# EAGLE design rpi_industrial_hat (EAGLE 9.6.2)
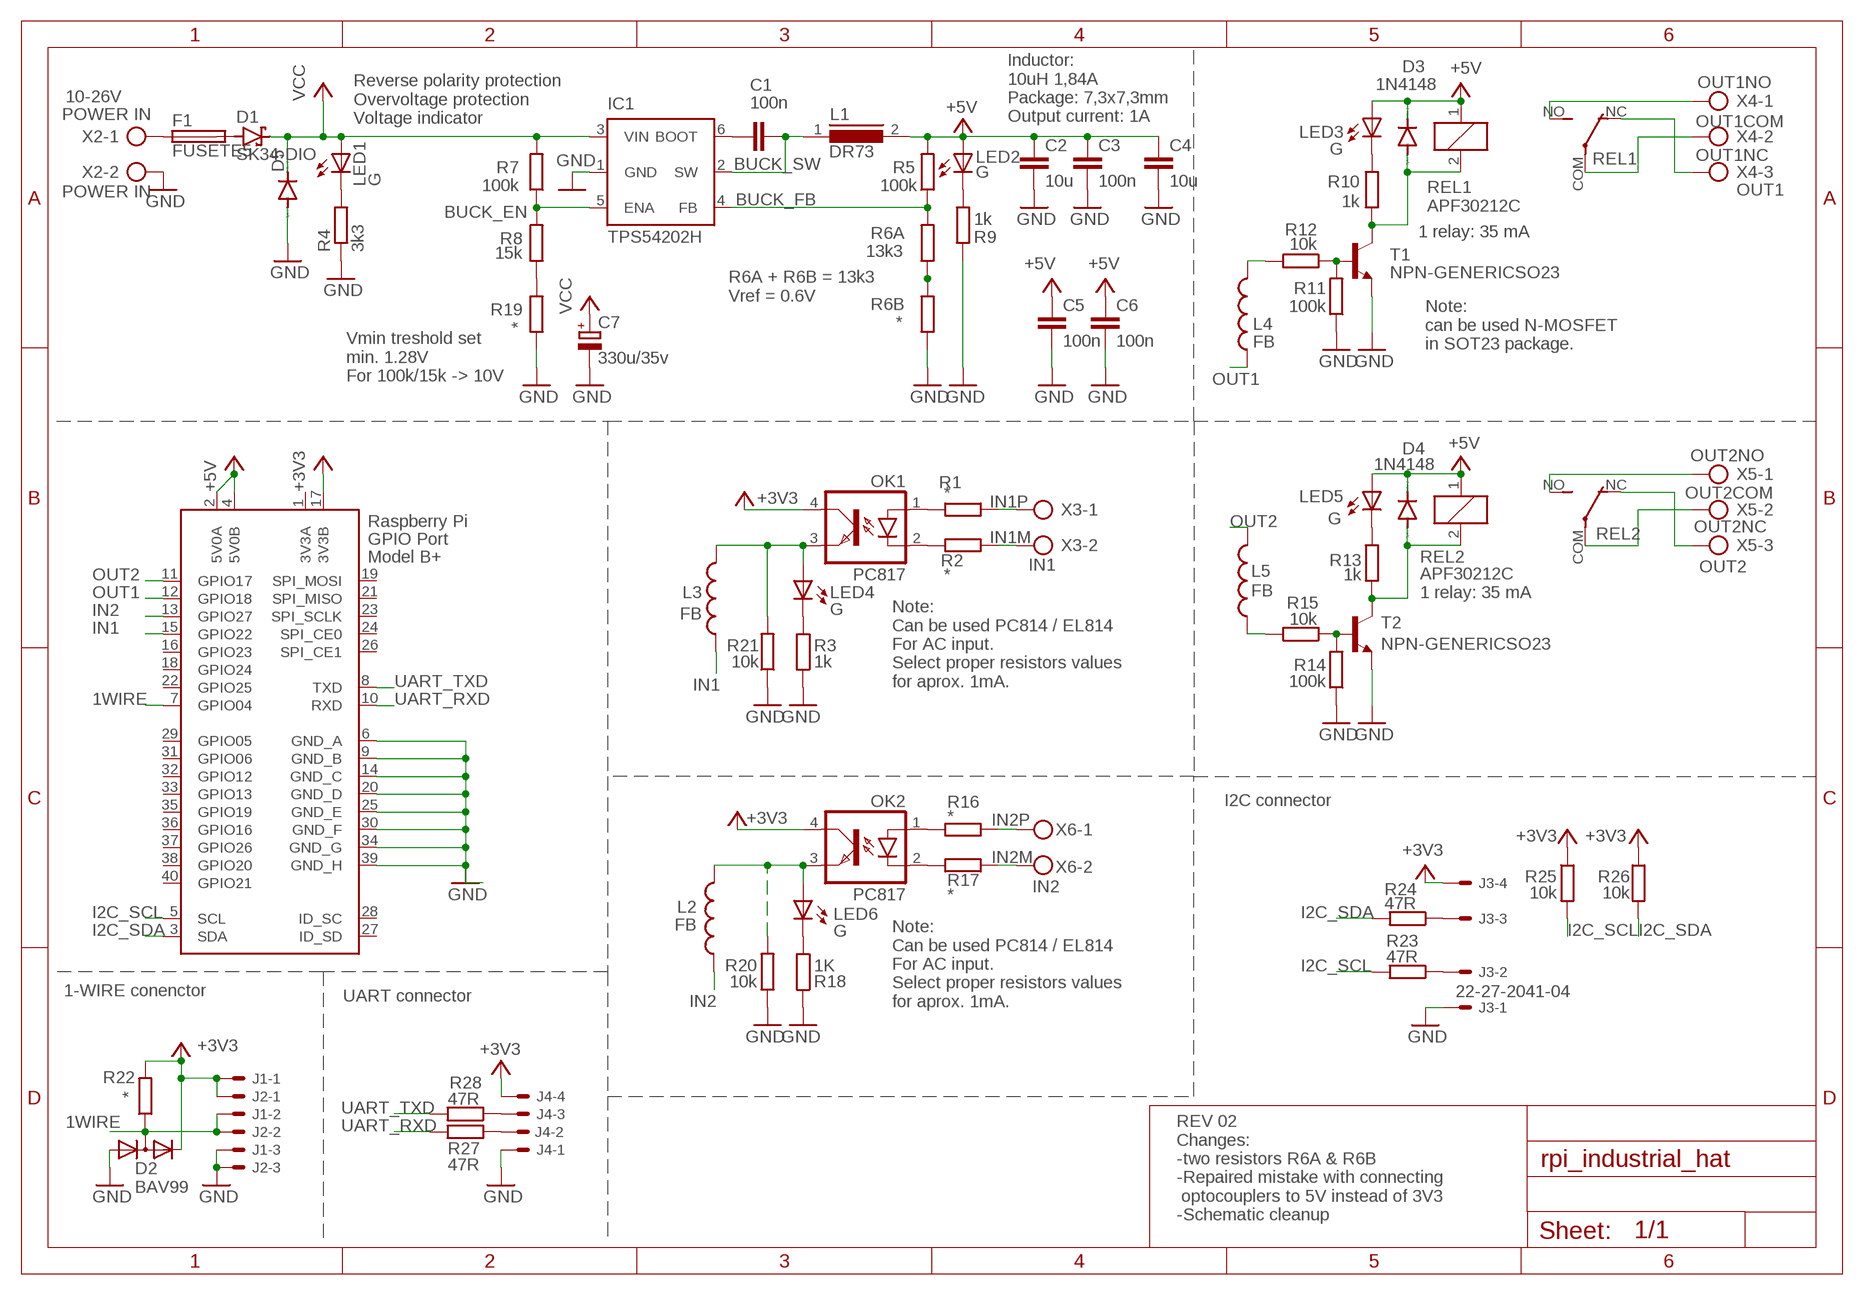
[diagram p0: schematic, sheet 1]

## Parts
C1  100n  C-EUC0603  [C0603]
C2  10u  C-EUC0805  [C0805]
C3  100n  C-EUC0603  [C0603]
C4  10u  C-EUC0805  [C0805]
C5  100n  C-EUC0603  [C0603]
C6  100n  C-EUC0603  [C0603]
C7  330u/35v  CPOL-EUE5-10.5  [E5-10,5]
D1  SK34-DIO  SCHOTTKY-DIODESMC  [SMC]
D2  BAV99  [SOT23]
D3  1N4148  DIODE-MINIMELF  [MINIMELF]
D4  1N4148  DIODE-MINIMELF  [MINIMELF]
D5  DIODE-DO214AA  [DO214AA]
F1  FUSETE5  [TE5]
IC1  TPS54202H  [SOT23-6]
J1  22-27-2031-03  [6410-03]
J2  22-27-2031-03  [6410-03]
J3  22-27-2041-04  [6410-04]
J4  22-27-2041-04  [6410-04]
L1  DR73  [DR73]
L2  FB  INDUCTOR0603  [0603]
L3  FB  INDUCTOR0603  [0603]
L4  FB  INDUCTOR0603  [0603]
L5  FB  INDUCTOR0603  [0603]
LED1  G  LEDCHIP-LED0603  [CHIP-LED0603]
LED2  G  LEDCHIP-LED0603  [CHIP-LED0603]
LED3  G  LEDCHIP-LED0603  [CHIP-LED0603]
LED4  G  LEDCHIP-LED0603  [CHIP-LED0603]
LED5  G  LEDCHIP-LED0603  [CHIP-LED0603]
LED6  G  LEDCHIP-LED0603  [CHIP-LED0603]
OK1  PC817  [DIL04]
OK2  PC817  [DIL04]
R1  *  R_PROTO_0204/7_0805  [0204/7/SMD]
R2  *  R_PROTO_0204/7_0805  [0204/7/SMD]
R3  1k  R-EU_R0603  [R0603]
R4  3k3  R-EU_R0603  [R0603]
R5  100k  R-EU_R0603  [R0603]
R6A  13k3  R-EU_R0603  [R0603]
R6B  *  R-EU_R0603  [R0603]
R7  100k  R-EU_R0603  [R0603]
R8  15k  R-EU_R0603  [R0603]
R9  1k  R-EU_R0603  [R0603]
R10  1k  R-EU_R0603  [R0603]
R11  100k  R-EU_R0603  [R0603]
R12  10k  R-EU_R0603  [R0603]
R13  1k  R-EU_R0603  [R0603]
R14  100k  R-EU_R0603  [R0603]
R15  10k  R-EU_R0603  [R0603]
R16  *  R_PROTO_0204/7_0805  [0204/7/SMD]
R17  *  R_PROTO_0204/7_0805  [0204/7/SMD]
R18  1K  R-EU_R0603  [R0603]
R19  *  R-EU_R0603  [R0603]
R20  10k  R-EU_R0603  [R0603]
R21  10k  R-EU_R0603  [R0603]
R22  *  R-EU_R0603  [R0603]
R23  47R  R-EU_R0603  [R0603]
R24  47R  R-EU_R0603  [R0603]
R25  10k  R-EU_R0603  [R0603]
R26  10k  R-EU_R0603  [R0603]
R27  47R  R-EU_R0603  [R0603]
R28  47R  R-EU_R0603  [R0603]
REL1  APF30212C  [APF30212C]
REL2  APF30212C  [APF30212C]
T1  NPN-GENERICSO23  [SOT23]
T2  NPN-GENERICSO23  [SOT23]
X1  RASPI_BOARD_B+#_E4P  [RASPI_BOARD_B+_EDGES_4DRILL_PAD]
X2  POWER IN  AK500/2  [AK500/2]
X3  IN1  AK500/2  [AK500/2]
X4  OUT1  AK500/3  [AK500/3]
X5  OUT2  AK500/3  [AK500/3]
X6  IN2  AK500/2  [AK500/2]

## Nets
1WIRE: D2.3(K1A2) J1.2 J2.2 R22.1 X1.7(GPIO04)
+3V3: D2.2(K2) J1.1 J2.1 J3.4 J4.4 OK1.4(COL) OK2.4(COL) R22.2 R25.1 R26.1 X1.17(3V3B)
+5V: C2.1 C3.1 C4.1 C5.1 C6.1 D3.C D4.C L1.2 LED2.A LED3.A LED5.A R5.2 REL1.1 REL2.1 X1.2(5V0A) X1.4(5V0B)
BUCK_EN: IC1.5(ENA) R7.1 R8.2
BUCK_FB: IC1.4(FB) R5.1 R6A.2
BUCK_SW: C1.2 IC1.2(SW) L1.1
GND: C2.2 C3.2 C4.2 C5.2 C6.2 C7.- D2.1(A1) D5.A IC1.1(GND) J1.3 J2.3 J3.1 J4.1 R3.1 R4.1 R6B.1 R9.1 R11.1 R14.1 R18.1 R19.1 R20.1 R21.1 T1.2(E) T2.2(E) X1.6(GND_A) X1.9(GND_B) X1.14(GND_C) X1.20(GND_D) X1.25(GND_E) X1.30(GND_F) X1.34(GND_G) X1.39(GND_H) X2.2
I2C_SCL: R23.2 R25.2 X1.5(SCL)
I2C_SDA: R24.2 R26.2 X1.3(SDA)
IN1: L3.1 X1.15(GPIO22)
IN1_: L3.2 LED4.A OK1.3(EMIT) R21.2
IN1M: R2.1 X3.2
IN1P: R1.1 X3.1
IN2: L2.1 X1.13(GPIO27)
IN2_: L2.2 LED6.A OK2.3(EMIT) R20.2
IN2M: R17.1 X6.2
IN2P: R16.1 X6.1
N$1: F1.1 X2.1
N$2: D1.A F1.2
N$3: R8.1 R19.2
N$4: J3.2 R23.1
N$5: J3.3 R24.1
N$6: OK1.1(A) R1.2
N$7: OK1.2(C) R2.2
N$8: J4.2 R27.1
N$9: J4.3 R28.1
N$10: LED4.C R3.2
N$11: C1.1 IC1.6(BOOT)
N$12: LED1.C R4.2
N$13: R6A.1 R6B.2
N$15: D3.A R10.1 REL1.2 T1.3(C)
N$18: LED2.C R9.2
N$19: LED3.C R10.2
N$20: R11.2 R12.1 T1.1(B)
N$21: D4.A R13.1 REL2.2 T2.3(C)
N$22: LED5.C R13.2
N$23: R14.2 R15.1 T2.1(B)
N$24: OK2.1(A) R16.2
N$25: OK2.2(C) R17.2
N$28: LED6.C R18.2
OUT1: L4.1 X1.12(GPIO18)
OUT1_: L4.2 R12.2
OUT1COM: REL1.COM(2:P) X4.2
OUT1NC: REL1.NC(2:O) X4.3
OUT1NO: REL1.NO(2:S) X4.1
OUT2: L5.2 X1.11(GPIO17)
OUT2_: L5.1 R15.2
OUT2COM: REL2.COM(2:P) X5.2
OUT2NC: REL2.NC(2:O) X5.3
OUT2NO: REL2.NO(2:S) X5.1
UART_RXD: R27.2 X1.10(RXD)
UART_TXD: R28.2 X1.8(TXD)
VCC: C7.+ D1.C D5.C IC1.3(VIN) LED1.A R7.2
Unconnected: X1.16(GPIO23) X1.18(GPIO24) X1.19(SPI_MOSI) X1.21(SPI_MISO) X1.22(GPIO25) X1.23(SPI_SCLK) X1.24(SPI_CE0) X1.26(SPI_CE1) X1.27(ID_SD) X1.28(ID_SC) X1.29(GPIO05) X1.31(GPIO06) X1.32(GPIO12) X1.33(GPIO13) X1.35(GPIO19) X1.36(GPIO16) X1.37(GPIO26) X1.38(GPIO20) X1.40(GPIO21)

## Notes on the sheet
- 10-26V
- POWER IN
- Inductor:
  10uH 1,84A
  Package: 7,3x7,3mm
  Output current: 1A
- Reverse polarity protection
  Overvoltage protection
  Voltage indicator
- 1 relay: 35 mA
- R6A + R6B = 13k3
  Vref = 0.6V
- Note:
  can be used N-MOSFET
  in SOT23 package.
- Vmin treshold set
  min. 1.28V
  For 100k/15k -> 10V
- 1 relay: 35 mA
- Note:
  Can be used PC814 / EL814
  For AC input.
  Select proper resistors values
  for aprox. 1mA.
- I2C connector
- 1-WIRE conenctor
- UART connector
- Note:
  Can be used PC814 / EL814
  For AC input.
  Select proper resistors values
  for aprox. 1mA.
- REV 02
  Changes:
  -two resistors R6A & R6B
  -Repaired mistake with connecting 
   optocouplers to 5V instead of 3V3
  -Schematic cleanup

## Power pins joined to a net without a drawn wire
3V3A: X1.1(3V3A)

## Library data of the parts
C1-C6 = rcl:C-EU: CAPACITOR, European symbol; SPICEPREFIX: C
C7 = rcl:CPOL-EU: POLARIZED CAPACITOR, European symbol; SPICEPREFIX: C
D1 = diode:SCHOTTKY-DIODE: Schottky Diode
D2 = nxp_60:BAV99: High-speed switching diode High-speed switching diodes, encapsulated in small Surface-Mounted Device (SMD) plastic packages. AAL Eindhoven MK
D3-D5 = diode:DIODE-: DIODE
F1 = fuse:FUSE: Fuse; OC_FARNELL: unknown; OC_NEWARK: unknown
IC1 = virtmedia:TPS54202H: TPS54202H 4.5-V to 28-V Input, 2-A Output, SWIFT™ Synchronous Step Down Voltage Converter Source: http://www.ti.com/lit/ds/symlink/tps54202h.pdf
J1 J2 = con-molex:22-?-03: CONNECTOR wire to board 2.54 mm (.1 inch) pitch header; MF: MOLEX; OC_FARNELL: unknown; OC_NEWARK: unknown
J3 J4 = con-molex:22-?-04: CONNECTOR wire to board 2.54 mm (.1 inch) pitch header; MF: MOLEX; OC_FARNELL: unknown; OC_NEWARK: unknown
L1 = inductors:DR73: High Power Density, High Efficiency, Shielded Inductors Source: coiltronics_dr_series.pdf; SPICEPREFIX: L
L2-L5 = SparkFun:INDUCTOR: Inductors Basic Inductor/Choke - 0603 and 1206. Footprints are not proven and vary greatly between part numbers.
LED1-LED6 = adafruit-3:LED: LED OSRAM: - CHIPLED LG R971, LG N971, LY N971, LG Q971, LY Q971, LO R971, LY R971 LH N974, LH R974 LS Q976, LO Q976, LY Q976 LO Q996 - Hyper CHIPLED LW Q18S LB Q993, LB Q99A, LB R99A - SideLED LS A670, LO A670, LY A670, LG A670, LP A670 LB A673, LV A673, LT A673, LW A673 LH A674 LY A675 LS A676, LA A676, LO A676, LY A676, LW A676 LS A679, LY A679, LG A679 - Hyper Micro SIDELED® LS Y876, LA Y876, LO Y876, LY Y876 LT Y87S - SmartLED LW L88C, LW L88S LB L89C, LB L89S, LG L890 LS L89K, LO L89K, LY L89K LS L896, LA L896, LO L896, LY L896 - TOPLED LS T670, LO T670, LY T670, LG T670, LP T670 LSG T670, LSP T670, LSY T670, LOP T670, LYG T670 LG T671, LOG T671, LSG T671 LB T673, LV T673, LT T673, LW T673 LH T674 LS T676, LA T676, LO T676, LY T676, LB T676, LH T676, LSB T676, LW T676 LB T67C, LV T67C, LT T67C, LS T67K, LO T67K, LY T67K, LW E67C LS E67B, LA E67B, LO E67B, LY E67B, LB E67C, LV E67C, LT E67C LW T67C LS T679, LY T679, LG T679 LS T770, LO T770, LY T770, LG T770, LP T770 LB T773, LV T773, LT T773, LW T773 LH T774 LS E675, LA E675, LY E675, LS T675 LS T776, LA T776, LO T776, LY T776, LB T776 LHGB T686 LT T68C, LB T68C - Hyper Mini TOPLED® LB M676 - Mini TOPLED Santana® LG M470 LS M47K, LO M47K, LY M47K Source: http://www.osram.convergy.de/
OK1 OK2 = optocoupler:PC817: SHARP OPTO COUPLER; MPN: PC817X4J000F; OC_FARNELL: 9707727; OC_NEWARK: 97K7059
R1 R2 R16 R17 = proto_components:R_PROTO_0204/7_0805: Resistor model for proto boards. Allows to mout at the same place THT axial or 0805/1206 SMT package.
R3-R5 R6A R6B R7-R15 R18-R28 = rcl:R-EU_: RESISTOR, European symbol; SPICEPREFIX: R
REL1 REL2 = relay:APF30212C: Compliant with European standards 1a/1c 6A Slim power relays Source: Data sheet <http://pewa.panasonic.com/assets/pcsd/catalog/pf-catalog.pdf>; OC_FARNELL: unknown
T1 T2 = virtmedia:NPN-GENERIC
X1 = Eagle Mixed Library:RASPI_BOARD_B+#: Raspberry Pi GPIO connector with markings for the outer dimensions of the Raspberry Pi board model B+ with different sets of drill holes or mounting pads All pins connected
X2 X3 X6 = con-ptr500:AK500/2: CONNECTOR; OC_FARNELL: unknown; OC_NEWARK: unknown
X4 X5 = con-ptr500:AK500/3: CONNECTOR; OC_FARNELL: unknown; OC_NEWARK: unknown

## Board
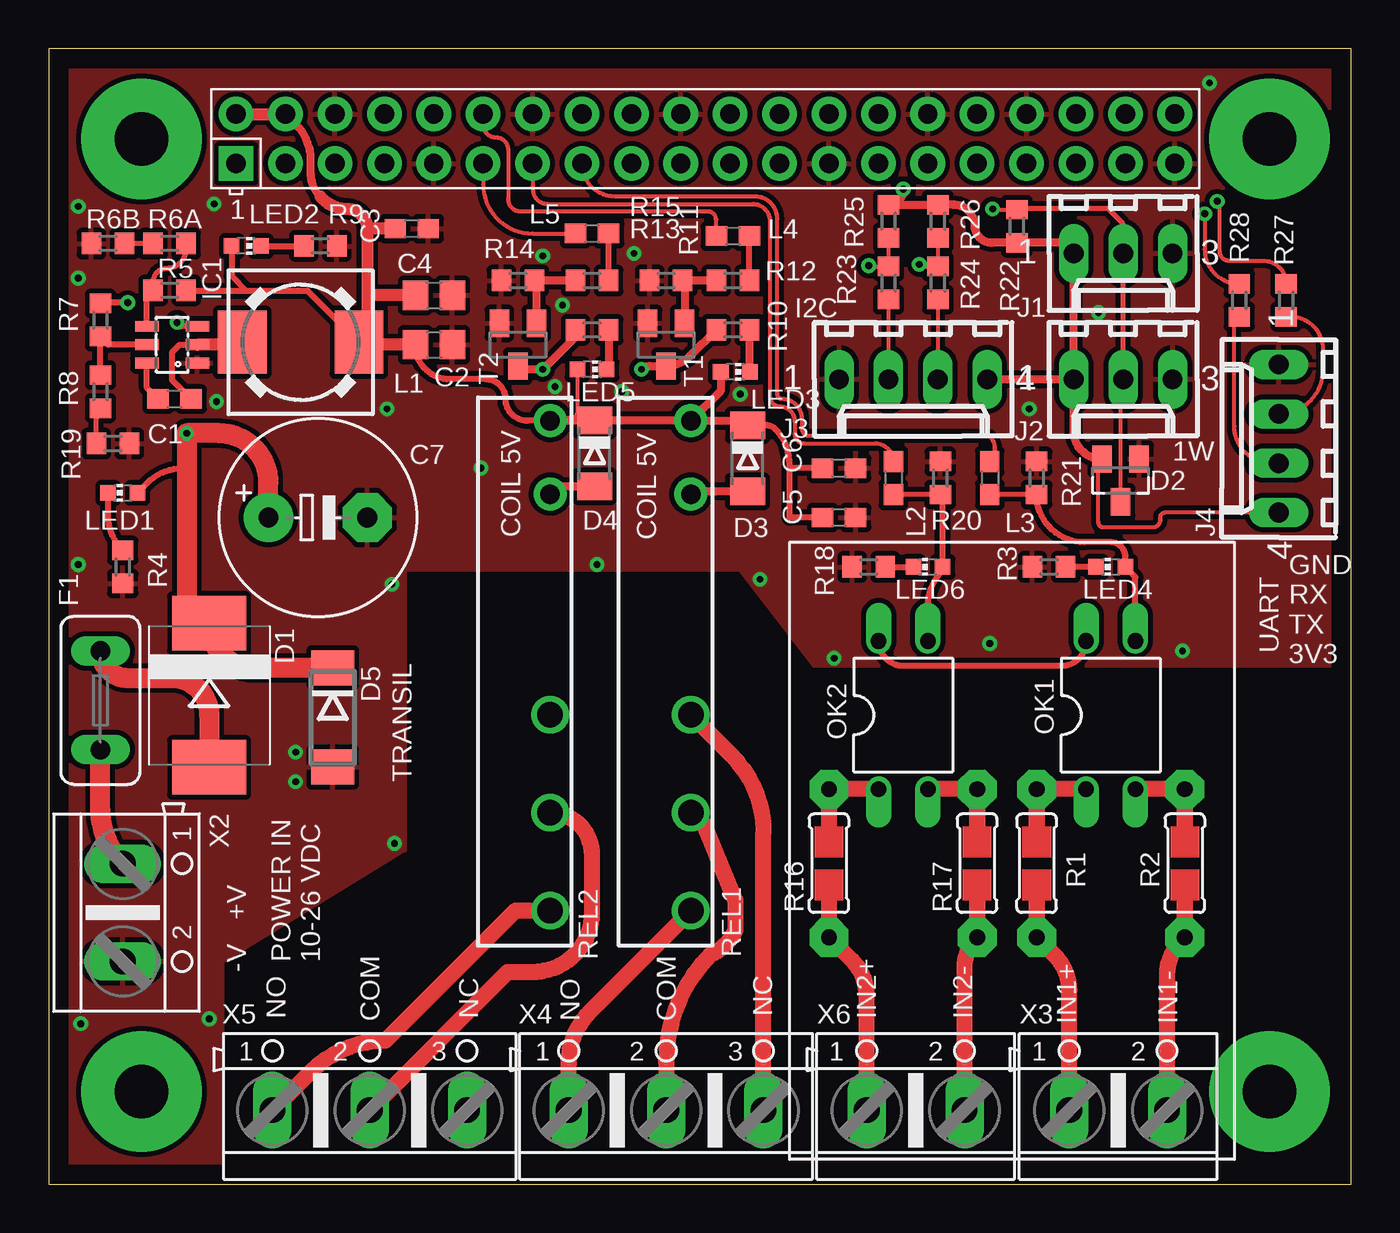
[diagram p1: board, top side]
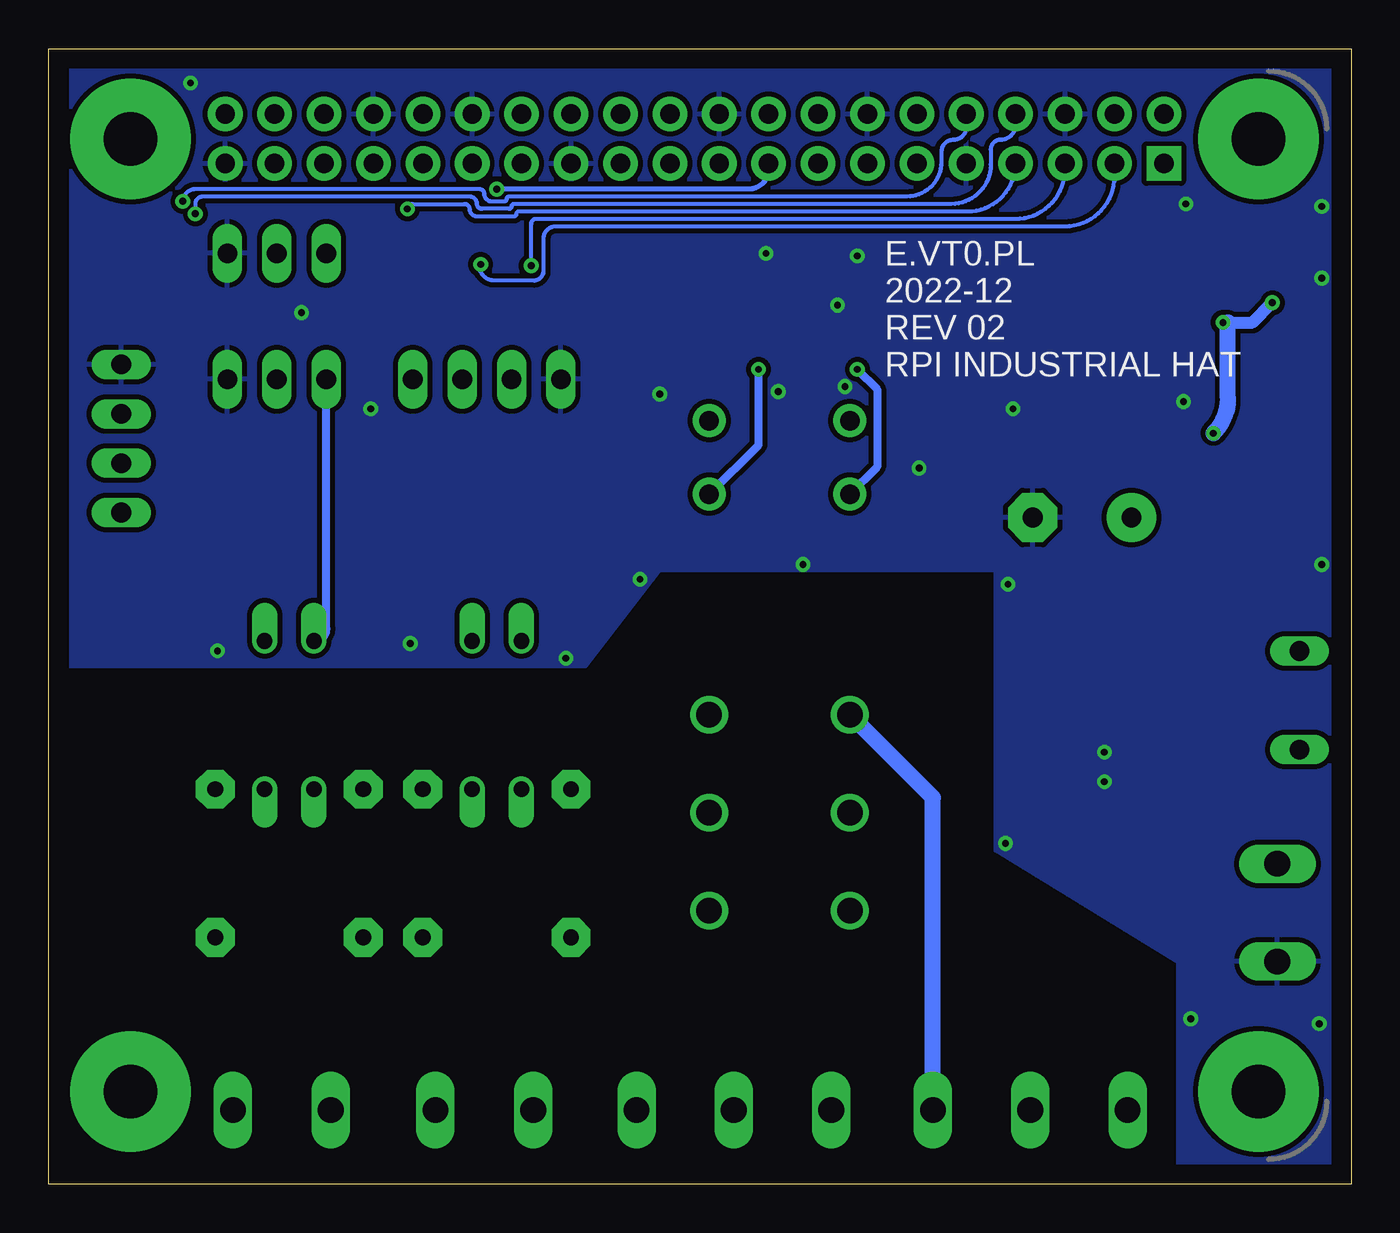
[diagram p2: board, bottom side, seen from below]

Size 66.98 x 58.41 mm. Coordinates in mm from the lower left corner, seen from the top.
Outline: 0,58.41 0,0 66.98,0 66.98,58.41 0,58.41
Copper layers (1*16): Top 0.035mm / dielectric 1.5mm / Bottom 0.035mm
Design rules "default": minimum track width 6mil, minimum drill 0.35mm, track to track 6mil, track to pad 6mil, pad to pad 6mil, via to via 6mil, smd to smd 6mil, copper to edge 40mil, drill to drill 6mil, minimum pad ring 10mil, minimum via ring 8mil, stop-mask expansion 4mil, vias tented up to drill 0mil, thermal gap 10mil

### Footprints (pad centres in the part's own frame; a part is rotated, then mirrored left to right if it is on the bottom)
C0603 = smd 1.1 x 1: 1 -0.85,0; 2 0.85,0
C0805 = smd 1.3 x 1.5: 1 -0.95,0; 2 0.95,0
E5-10,5 = drill 1.016 pad 2.54: + -2.54,0 | drill 1.016 pad 2.54 octagon: - 2.54,0
SMC = smd 2.8 x 3.8: A 3.7,0; C -3.7,0
SOT23 = smd 1 x 1.4: 1 -0.95,-1.1; 2 0.95,-1.1; 3 0,1.1
MINIMELF = smd 1.4 x 1.8: A 1.7,0; C -1.7,0
DO214AA = smd 1.8 x 2.2: A 2.55,0; C -2.55,0
TE5 = drill 1.016 long: 1 -2.54,0; 2 2.54,0
SOT23-6 = smd 0.55 x 1.2: 1 -0.95,-1.3; 2 0,-1.3; 3 0.95,-1.3; 4 0.95,1.3; 5 0,1.3; 6 -0.95,1.3
6410-03 = drill 1.016 long: 1 2.54,0; 2 0,0; 3 -2.54,0
6410-04 = drill 1.016 long: 1 3.81,0; 2 1.27,0; 3 -1.27,0; 4 -3.81,0
DR73 = smd 2.5 x 3.25: 1 -3,0; 2 3,0
0603 = smd 1.1 x 1: 1 -0.85,0; 2 0.85,0
CHIP-LED0603 = smd 0.8 x 0.8: A 0,-0.75; C 0,0.75
DIL04 = drill 0.813 offset: 1 -1.27,-3.81; 2 1.27,-3.81; 3 1.27,3.81; 4 -1.27,3.81
0204/7/SMD = drill 0.813 pad 2 octagon: 1 -3.81,0; 2 3.81,0
R0603 = smd 1 x 1.1: 1 -0.85,0; 2 0.85,0
APF30212C = drill 1 pad 1.7: 1 -12.6,0; 2 -8.82,0 | drill 1.3 pad 1.9: COM 7.56,0; NC 2.52,0; NO 12.6,0
RASPI_BOARD_B+_EDGES_4DRILL_PAD = drill 1 pad 1.778 square: 1 8.37,51.23 | drill 1 pad 1.778: 2 8.37,53.77; 3 10.91,51.23; 4 10.91,53.77; 5 13.45,51.23; 6 13.45,53.77; 7 15.99,51.23; 8 15.99,53.77; 9 18.53,51.23; 10 18.53,53.77; 11 21.07,51.23; 12 21.07,53.77; 13 23.61,51.23; 14 23.61,53.77; 15 26.15,51.23; 16 26.15,53.77; 17 28.69,51.23; 18 28.69,53.77; 19 31.23,51.23; 20 31.23,53.77; 21 33.77,51.23; 22 33.77,53.77; 23 36.31,51.23; 24 36.31,53.77; 25 38.85,51.23; 26 38.85,53.77; 27 41.39,51.23; 28 41.39,53.77; 29 43.93,51.23; 30 43.93,53.77; 31 46.47,51.23; 32 46.47,53.77; 33 49.01,51.23; 34 49.01,53.77; 35 51.55,51.23; 36 51.55,53.77; 37 54.09,51.23; 38 54.09,53.77; 39 56.63,51.23; 40 56.63,53.77 | drill 2.75 pad 6.2: 41 3.5,3.5; 42 61.5,3.5; 43 61.5,52.5; 44 3.5,52.5
AK500/2 = drill 1.321 long: 1 -2.515,0; 2 2.515,0
AK500/3 = drill 1.321 long: 1 -5.004,0; 2 0,0; 3 5.004,0

### Placement (x,y rotation side)
C1  6.48,40.39 0 top
C2  19.81,43.18 0 top
C3  18.67,49.15 0 top
C4  19.81,45.72 0 top
C5  40.64,34.29 0 top
C6  40.64,36.83 0 top
C7  13.84,34.29 0 top
D1  8.26,25.15 270 top
D2  55.12,36.2 180 top
D3  35.94,37.34 270 top
D4  28.07,37.59 270 top
D5  14.61,24 270 top
F1  2.67,24.89 90 top
IC1  6.35,43.18 90 top
J1  55.25,47.88 180 top
J2  55.25,41.4 180 top
J3  44.45,41.4 180 top
J4  63.25,38.35 90 top
L1  12.95,43.31 0 top
L2  43.43,36.32 270 top
L3  48.39,36.32 270 top
L4  35.18,48.77 0 top
L5  27.94,48.9 180 top
LED1  3.81,35.56 90 top
LED2  10.16,48.26 270 top
LED3  35.31,41.78 270 top
LED4  54.61,31.75 90 top
LED5  27.94,41.91 270 top
LED6  45.21,31.75 90 top
OK1  54.61,24.13 0 top
OK2  43.94,24.13 0 top
R1  50.8,16.51 90 top
R2  58.42,16.51 90 top
R3  51.44,31.75 0 top
R4  3.81,31.75 90 top
R5  6.22,45.97 0 top
R6A  6.22,48.39 0 top
R6B  3.05,48.39 0 top
R7  2.67,44.45 90 top
R8  2.67,40.77 90 top
R9  13.97,48.26 180 top
R10  35.18,43.94 0 top
R11  31.75,46.48 0 top
R12  35.18,46.48 0 top
R13  27.94,43.94 0 top
R14  24.13,46.48 0 top
R15  27.94,46.48 0 top
R16  40.12,16.51 90 top
R17  47.74,16.51 90 top
R18  42.16,31.75 0 top
R19  3.3,38.1 180 top
R20  45.85,36.32 270 top
R21  50.8,36.32 270 top
R22  49.78,49.28 270 top
R23  43.18,46.36 90 top
R24  45.72,46.36 90 top
R25  43.18,49.53 270 top
R26  45.72,49.53 270 top
R27  63.63,45.47 90 top
R28  61.21,45.47 90 top
REL1  33.02,26.67 270 top
REL2  25.78,26.67 270 top
T1  31.75,43.18 180 top
T2  24.13,43.18 180 top
X1  1.27,1.27 0 top
X2  3.81,13.97 270 top
X3  54.99,3.81 0 top
X4  31.75,3.81 0 top
X5  16.51,3.81 0 top
X6  44.58,3.81 0 top

### Tracks (layer width: path | path; a pad name or v marks a point on that pad's centre or on a via)
1WIRE  (via drill 0.35)
  Top 0.203: v48.53,50.17 arc-90 48.57,50.13 R22.1 | D2.3 55.12,41.78 arc-90 55.25,41.91
  Top 0.254: J2.2 55.25,41.91 J1.2 55.25,49.4 54.48,50.17 49.82,50.17 R22.1
  Bottom 0.203: v48.53,50.17 48.51,50.17 arc90 48.26,50.42 45.59,50.42 arc90 45.34,50.17 arc-90 44.96,49.78 43.05,49.78 arc-90 42.93,49.91 arc90 42.8,50.04 19.72,50.04 arc-90 X1.7
+3V3  (via drill 0.35)
  Top 0.203: J4.4 57.4,34.54 arc90 57.15,34.29 57.15,34.16 arc-90 56.77,33.78 54.23,33.78 arc-90 53.98,34.04 53.98,37.1 arc-90 D2.2 | v43.94,51.18 43.94,51.14
  Top 0.305: OK2.4 arc90 43.94,26.67 52.07,26.67 arc90 OK1.4
  Top 0.406: 52.71,41.91 J2.1 52.71,38.76 arc90 D2.2 | 52.71,41.91 J1.1 52.16,48.43 R22.2 48.48,48.43 arc-90 47.62,49.28 arc90 46.52,50.38 R26.1 R25.1 arc90 43.94,51.14 | J3.4 52.2,41.4 arc90 52.71,41.91
  Bottom 0.254: X1.17 29.96,52.21 arc90 30.99,51.18 v43.94,51.18
  Bottom 0.406: OK1.4 arc-90 52.71,28.57 J2.1
+5V
  Top 0.203: LED5.A 27.19,39.79 arc-90 26.67,39.27
  Top 0.305: R5.2 10.16,45.97 | 10.16,45.97 13.29,45.97 L1.2 | LED2.A 9.41,46.72 10.16,45.97 | D3.C 36.91,39.04 arc-45 37.34,38.86 37.36,38.84 arc-45 38.1,37.05 38.1,36.83 | 38.1,36.83 38.1,34.29 C5.1 | C6.1 38.1,36.83 | REL2.1 24.61,39.27 arc-90 23.5,40.39 arc90 22.48,41.4 20.63,41.4 arc-90 C2.1
  Top 0.406: D4.C 25.8,39.29 REL2.1 26.67,39.27 REL1.1 | 16.3,42.97 L1.2 | REL1.1 35.38,39.27 arc-45 D3.C | LED3.A 34.56,40.81 REL1.1 | X1.4 12.72,54.5 arc-45 13.46,52.71 13.46,52.03 arc45 13.97,50.8
  Top 0.61: X1.2 X1.4 | 13.97,50.8 14.07,50.7 arc45 15.37,50.17 arc-45 16.02,49.9 16.13,49.78 arc-45 16.38,49.17 | 16.38,43.18 arc-45 16.3,42.97 | 16.38,49.17 16.38,45.72 | 16.38,45.72 16.38,43.18 | C2.1 arc-45 C2.1 16.38,43.18 | C4.1 16.38,45.72 | C3.1 16.44,49.15 arc-45 16.38,49.17
BUCK_EN
  Top 0.305: IC1.5 3.09,43.18 R7.1 R8.2
BUCK_FB
  Top 0.254: R5.1 5.37,46.39 arc-90 6.1,47.12 arc90 7.07,48.09 R6A.2
  Top 0.305: IC1.4 5.05,45.65 R5.1
BUCK_SW
  Top 0.305: C1.2 6.35,41.36 6.35,42.8 6.73,43.18 IC1.2
  Top 0.61: L1.1 9.83,43.18 IC1.2
GND  (via drill 0.35)
  other vias: 53.98,44.83 35.56,40.64 26.04,41.02 1.65,8.26 8.26,8.51 17.78,17.53 17.65,30.86 36.58,31.11 28.19,31.88 40.39,27.05 1.52,31.88 1.52,46.61 1.52,50.29 8.51,50.42 17.4,39.88 8.64,40.26 22.22,36.83 59.69,56.64 58.29,27.43 48.39,27.81 50.42,39.88 29.46,40.77 30.1,47.88 25.4,47.75 26.42,45.21 12.7,22.22 12.7,20.7
  pour Top (isolate 0.254): 0,58.42 66.04,58.42 66.04,26.67 39.37,26.67 35.56,31.62 18.29,31.62 18.29,17.19 8.89,11.43 8.89,0 0,0
  pour Bottom (isolate 0.254): 0,58.42 66.04,58.42 66.04,26.67 39.37,26.67 35.56,31.62 18.29,31.62 18.29,17.19 8.89,11.43 8.89,0 0,0
I2C_SCL  (via drill 0.35)
  Top 0.203: R25.2 R23.2 42.2,47.21 arc-90 v42.16,47.24
  Bottom 0.203: X1.5 14.72,52.2 arc90 17.26,49.66 41.91,49.66 arc-90 42.16,49.4 v42.16,47.24
I2C_SDA  (via drill 0.35)
  Top 0.203: R26.2 R24.2 44.87,47.21 arc-90 v44.77,47.31
  Bottom 0.203: X1.3 12.18,52.45 12.18,51.82 arc90 14.72,49.28 40.89,49.28 arc-90 41.53,48.64 41.53,46.99 arc90 42.04,46.48 44.07,46.48 arc90 44.83,47.24 arc90 v44.77,47.31
IN1
  Top 0.203: L3.1 arc90 48.39,38.48 39.12,38.48 arc-90 38.74,38.86 38.74,39.37 arc90 37.72,40.39 arc-90 37.47,40.64 37.47,49.66 arc90 36.32,50.8 29.12,50.8 arc-90 X1.15
IN1_
  Top 0.254: R21.2 L3.2
  Top 0.305: OK1.3 55.88,31.23 LED4.A 55.36,32.27 arc90 54.61,33.02 53.25,33.02 arc-90 R21.2
IN1M
  Top 0.813: X3.2 57.51,10.73 arc-45 58.25,12.53 R2.1
IN1P
  Top 0.813: X3.1 52.48,9.97 arc45 51.73,11.77 R1.1
IN2
  Top 0.203: X1.13 24.88,51.32 arc90 24.89,51.31 24.89,51.18 arc90 25.65,50.42 36.2,50.42 arc-90 37.08,49.53 37.08,40.51 arc90 37.59,40.01 arc-90 38.35,39.24 38.35,38.61 arc90 38.86,38.1 42.51,38.1 arc-90 L2.1
IN2_
  Top 0.254: R20.2 L2.2
  Top 0.305: OK2.3 45.21,29.77 arc-45 45.96,31.56 LED6.A 45.96,35.36 arc90 R20.2
IN2M
  Top 0.813: X6.2 47.09,11.13 arc-45 R17.1
IN2P
  Top 0.813: X6.1 42.06,9.71 arc45 41.32,11.5 R16.1
N$1
  Top 1.016: X2.1 arc-45 2.67,19.24 F1.1
N$2
  Top 1.016: F1.2 arc90 4.06,26.04 6.35,26.04 arc-90 8.26,24.13 D1.A
N$3
  Top 0.254: R19.2 2.45,39.4 arc-45 R8.1
N$4
  Top 0.203: R23.1 J3.2
N$5
  Top 0.203: R24.1 J3.3
N$6
  Top 0.813: OK1.1 R1.2
N$7
  Top 0.813: R2.2 OK1.2
N$8
  Top 0.203: J4.2 arc90 65.53,41.91 65.53,42.93 arc90 63.84,44.62 R27.1
N$9
  Top 0.203: J4.3 62.87,37.08 arc-90 60.96,38.99 60.96,44.36 arc-90 R28.1
N$10
  Top 0.305: LED4.C arc45 53.69,31.75 R3.2
N$11
  Top 0.305: C1.1 5.05,40.96 IC1.6
N$12
  Top 0.305: R4.2 R4.2 arc-45 3.06,34.4 LED1.C
N$13
  Top 0.254: R6A.1 R6B.2
N$15  (via drill 0.35)
  Top 0.406: v30.48,41.91 arc-45 30.89,42.08 T1.3 arc45 32.97,42.59 R10.1 | D3.A 33.38,35.64 arc45 REL1.2
  Bottom 0.406: REL1.2 30.48,38.03 v30.48,41.91
N$18
  Top 0.305: LED2.C R9.2
N$19
  Top 0.406: R10.2 36.03,41.85 arc45 LED3.C
N$20
  Top 0.406: T1.1 32.7,46.24 arc45 R11.2 R12.1
N$21  (via drill 0.35)
  Top 0.406: D4.A 26.18,35.89 REL2.2 | T2.3 arc45 24.54,41.91 v25.4,41.91 27.09,43.6 arc45 R13.1
  Bottom 0.406: REL2.2 24.38,36.89 24.38,40.89 v25.4,41.91
N$22
  Top 0.406: R13.2 28.79,42.15 arc-45 LED5.C
N$23
  Top 0.406: R15.1 R14.2 arc-45 25.08,46.24 T2.1
N$24
  Top 0.813: OK2.1 R16.2
N$25
  Top 0.813: R17.2 OK2.2
N$28
  Top 0.305: R18.2 44.41,31.75 arc-45 44.45,31.77 LED6.C
OUT1
  Top 0.203: X1.12 22.34,54.5 arc90 22.99,53.85 arc-90 23.62,53.21 23.62,50.67 arc90 24.26,50.04 33.91,50.04 arc-90 34.29,49.66 arc-90 34.33,49.62 L4.1
OUT1_
  Top 0.305: R12.2 L4.2
OUT1COM
  Top 0.813: REL1.COM arc-45 33.75,18.38 35.31,14.62 35.31,13.08 arc-45 34.04,11.81 arc45 31.75,6.29 X4.2
OUT1NC
  Top 0.813: X4.3 36.75,18.09 arc45 35.11,22.06 REL1.NC
OUT1NO
  Top 0.813: X4.1 26.75,6.22 arc-45 27.86,8.91 REL1.NO
OUT2
  Top 0.203: X1.11 22.34,51.44 arc90 24.88,48.9 L5.2
OUT2_
  Top 0.305: R15.2 L5.1
OUT2COM
  Top 0.813: X5.2 23.59,10.88 arc-90 23.62,10.92 24.89,10.92 arc90 27.94,13.97 27.94,16.95 arc90 REL2.COM
OUT2NC
  Bottom 0.813: X5.3 21.51,19.88 REL2.NC
OUT2NO
  Top 0.813: REL2.NO 24,14.07 17.31,7.38 arc45 13.49,5.79 X5.1
UART_RXD  (via drill 0.35)
  Top 0.203: v60.08,50.55 arc-90 60.2,50.44 60.2,48.01 arc90 60.71,47.5 62.45,47.5 arc-90 R27.2
  Bottom 0.203: X1.10 19.8,54.37 arc90 20.45,53.72 arc-90 21.08,53.09 21.08,52.58 arc90 22.86,50.8 43.31,50.8 arc-90 43.43,50.67 arc90 43.56,50.55 44.2,50.55 arc90 44.58,50.93 arc-90 44.83,51.18 59.44,51.18 arc-90 60.07,50.55 arc90 v60.08,50.55
UART_TXD  (via drill 0.35)
  Top 0.203: v59.44,49.91 59.44,48.09 arc90 R28.2
  Bottom 0.203: X1.8 17.26,54.5 arc90 18.03,53.72 arc-90 18.54,53.21 18.54,52.45 arc90 20.57,50.42 43.05,50.42 arc-90 43.18,50.29 arc90 43.31,50.17 44.7,50.17 arc90 44.96,50.42 arc-90 45.34,50.8 59.05,50.8 arc-90 59.44,50.42 v59.44,49.91
VCC  (via drill 0.35)
  Top 0.203: v7.09,38.63 7.09,37.04 arc-90 6.88,36.83 | D1.C 7.98,28.85 arc-90 7.62,29.21
  Top 0.305: IC1.3 6.8,44.13 v6.6,44.32 | v4.06,45.34 2.71,45.34 R7.2 | LED1.A 5.09,36.09 arc-45 6.88,36.83
  Top 1.016: D5.C 10.55,26.55 arc-90 D1.C | 7.62,29.21 arc-90 7.09,29.74 v7.09,38.63 8.76,38.63 arc-90 11.3,36.09 C7.+
  Bottom 0.61: v6.6,44.32 6.35,44.32 5.08,44.32 v4.06,45.34
  Bottom 0.813: v7.09,38.63 arc-45 6.35,40.42 6.35,44.32

### Text on the board
tNames: I2C | 1W | COIL 5V | COIL 5V | UART | GND / RX / TX / 3V3 | TRANSIL | -V +V | POWER IN / 10-26 VDC | NO | COM | NC | NO | COM | NC | IN2+ | IN2- | IN1+ | IN1-
bNames: E.VT0.PL / 2022-12 / REV 02 / RPI INDUSTRIAL HAT